# EasyEDA schematic Section_3_2020-11-02_18-49-52.json
TITLE: Sheet_1; REV: 1.0; Date: 2020-11-02; Sheet: 1/1; Company: Your Company
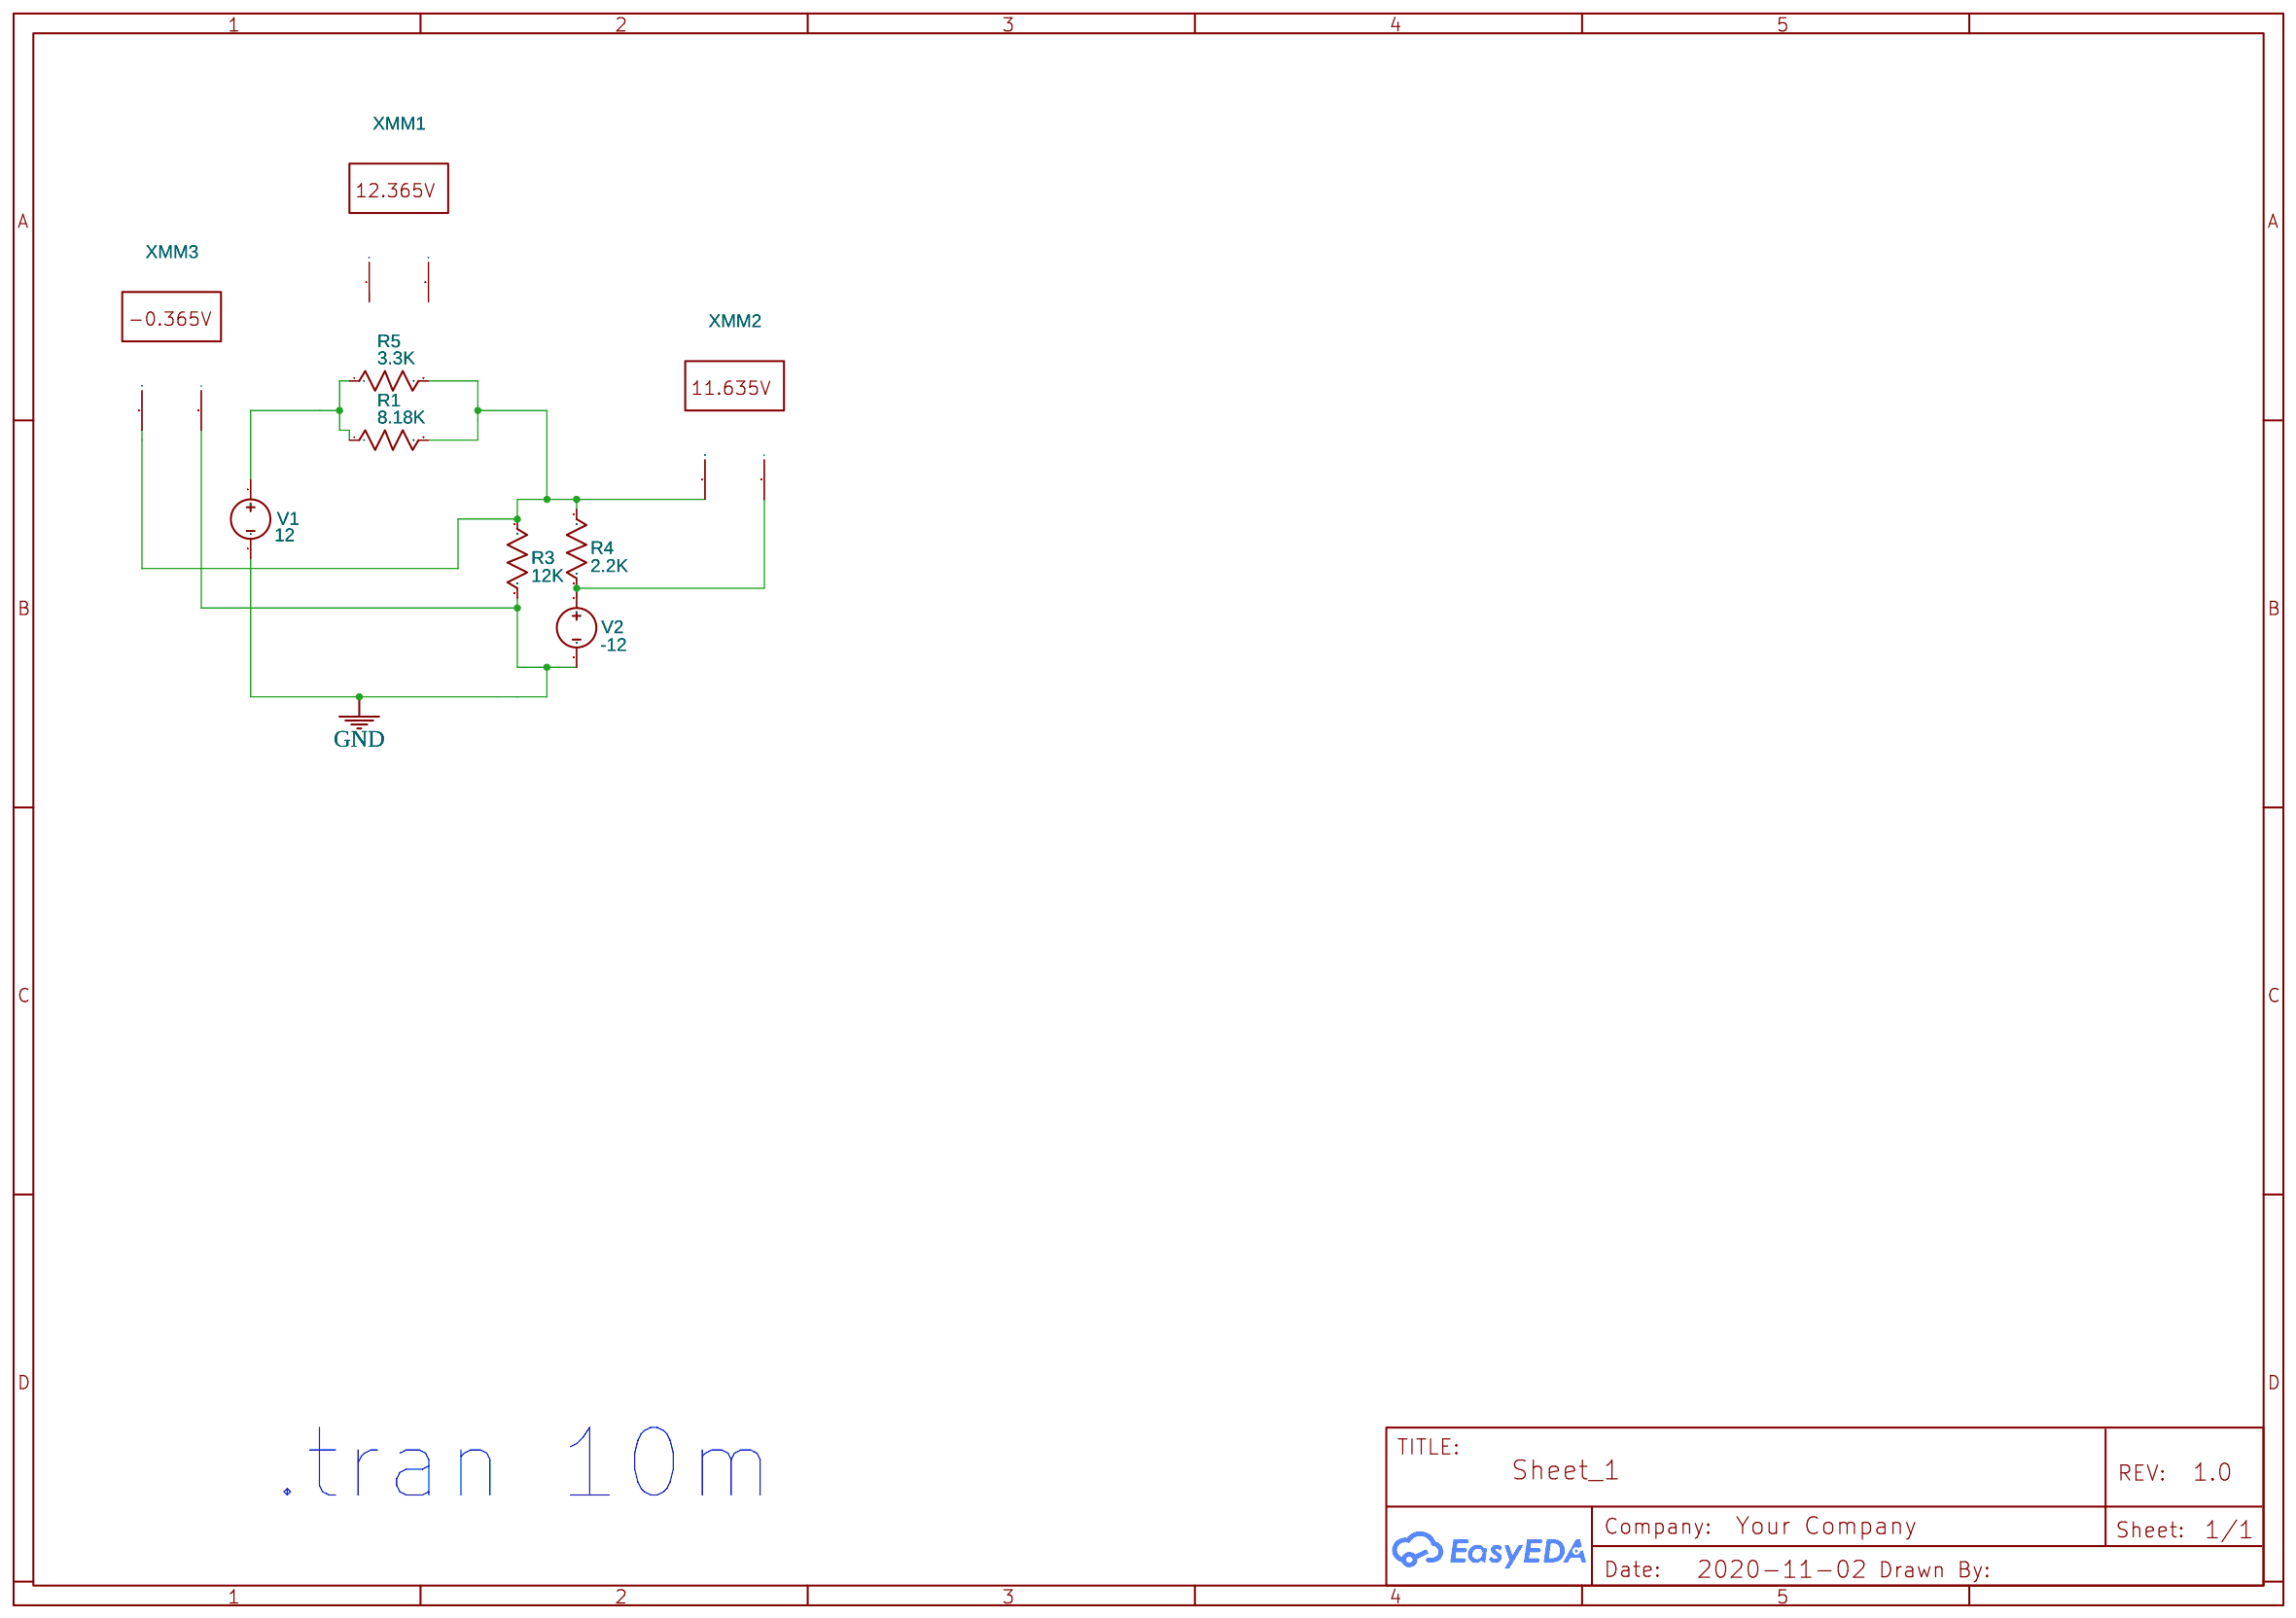
[diagram p0: schematic sheet]

## Parts
R1  8.18K  [AXIAL-0.3]
R3  12K  [AXIAL-0.3]
R4  2.2K  [AXIAL-0.3]
R5  3.3K  [AXIAL-0.3]
V1  12  [HDR1X2]
V2  -12  [HDR1X2]
XMM1  Multimeter
XMM2  Multimeter
XMM3  Multimeter

## Library data of the parts
R1 R3-R5 = Resistor_US: Resistance: 1k; Contributor: EasyEDA; Supplier: YUJING
V1 V2 = VDC: Contributor: EasyEDA; sim: true
XMM1-XMM3 = MULTIMETER: Supplier: LCSC; Multimeter Type: Voltmeter; Power Type: AC; Voltmeter resistance: 10μ; Ammeter resistance: 1G; NameDisplay: 0; Contributor: EasyEDA; sim: true

## Nets
GND: R3.2 V1.2 V2.2 XMM3.2(I)
Net-(R1-1): R1.1 R5.1 V1.1
Net-(R1-2): R1.2 R3.1 R4.1 R5.2 XMM2.1(+) XMM3.1(+)
Net-(R4-2): R4.2 V2.1 XMM2.2(I)

Not connected (* = marked no-connect by the designer): XMM1 1(+) 2(I)

## Notes on the sheet
- .tran 10m
